# EAGLE design Frequency_Control (EAGLE 6.3)
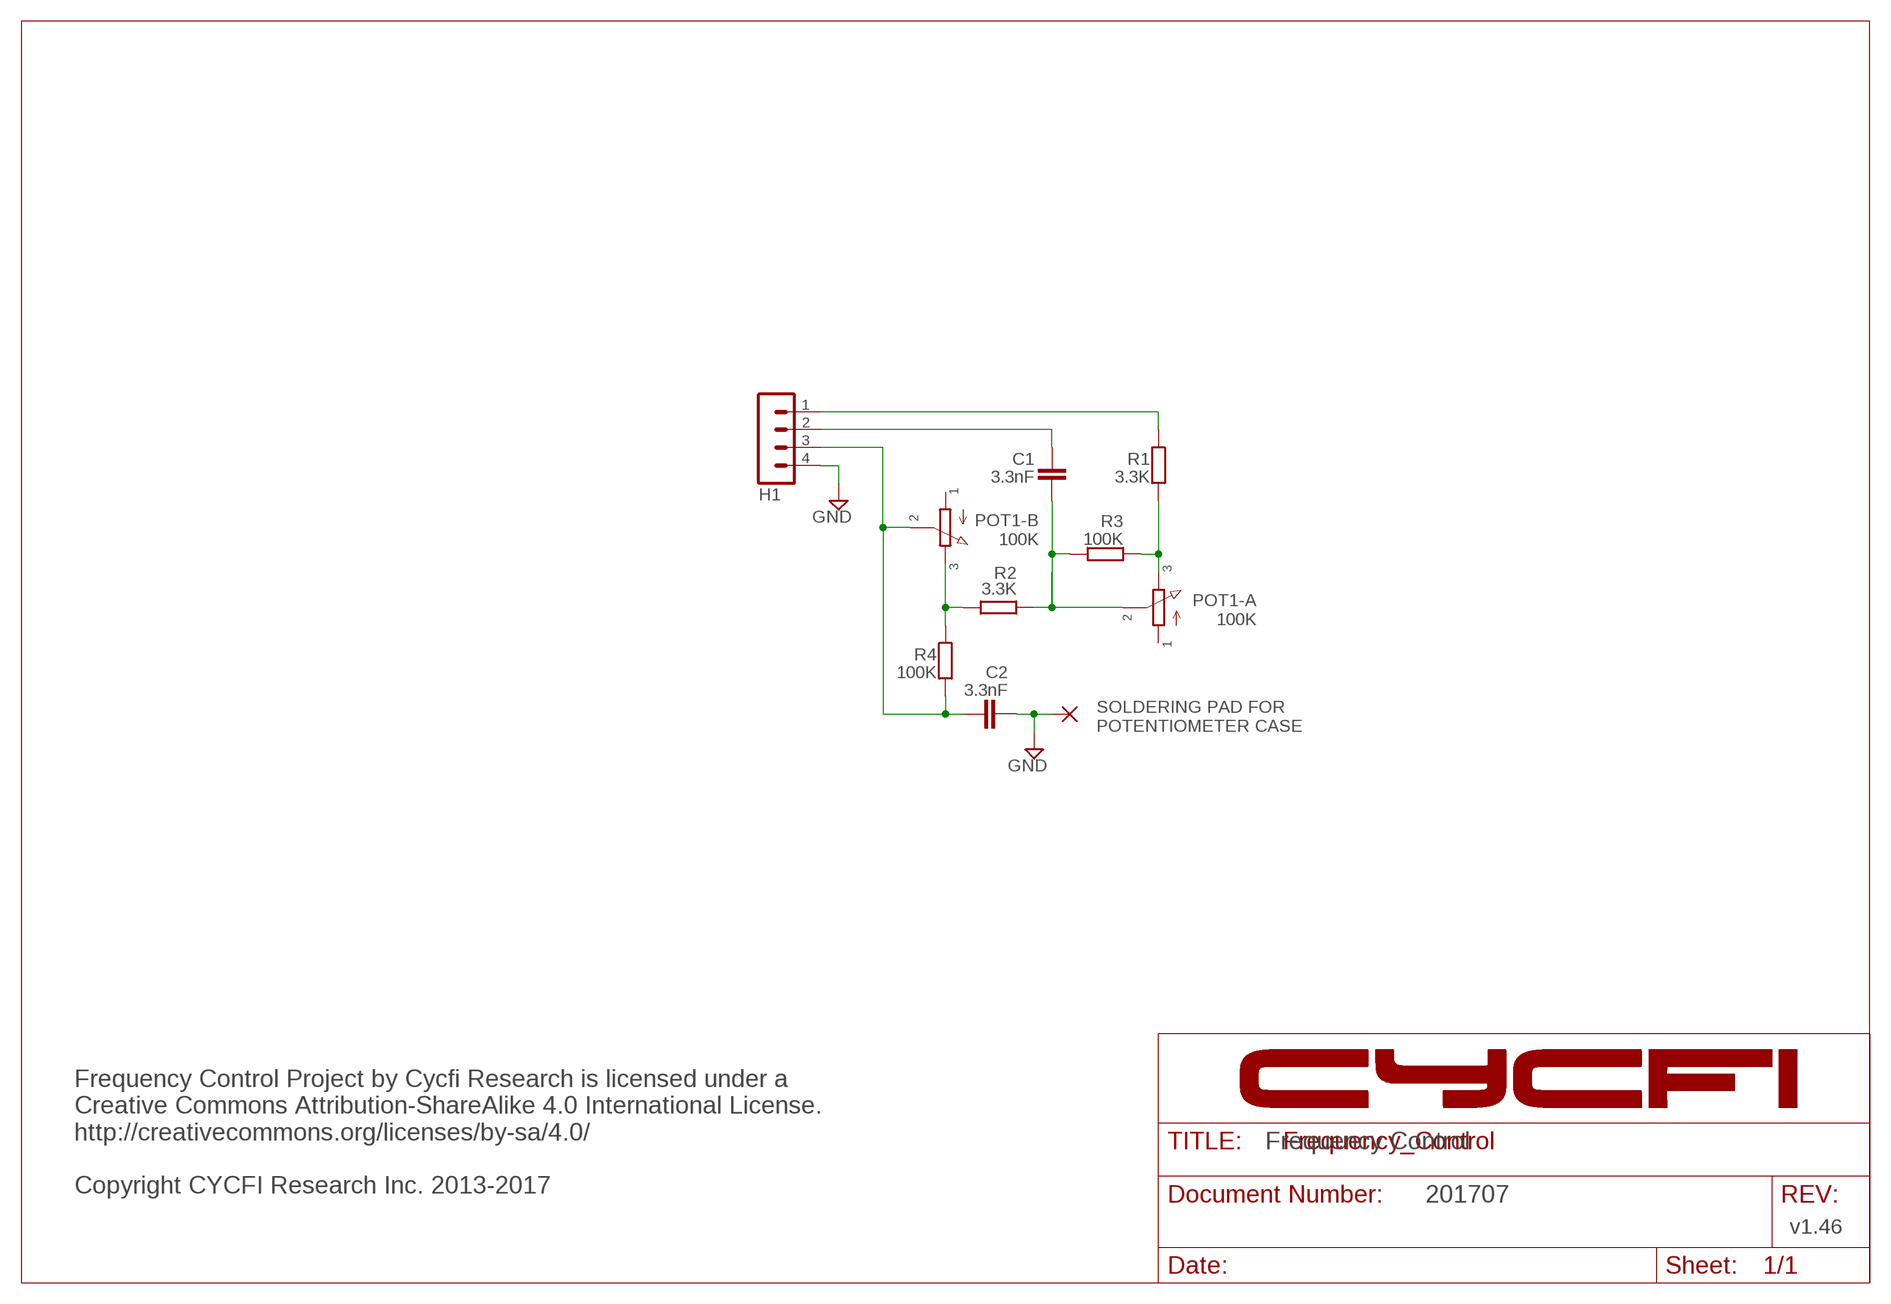
[diagram p0: schematic, sheet 1]

## Parts
C1  3.3nF  C-EUC0805  [C0805]
C2  3.3nF  C-EUC0805  [C0805]
H1  MA04-1  [MA04-1]
PAD1  1,6/0,9  [1,6/0,9]
POT1-A  PDB182-GTR02  [PDB182-GTR01]
R1  3.3K  R-EU_R0603  [R0603]
R2  3.3K  R-EU_R0603  [R0603]
R3  100K  R-EU_R0402  [R0402]
R4  100K  R-EU_R0402  [R0402]

## Nets
1: H1.1 R1.1
2: C1.2 H1.2
3: C2.1 H1.3 POT1-A.B2 R4.2
GND: C2.2 H1.4 PAD1.1(P)
N$1: POT1-A.A3 R1.2 R3.2
N$2: C1.1 POT1-A.A2 R2.1 R3.1
N$3: POT1-A.B3 R2.2 R4.1
Unconnected: POT1-A.A1 POT1-A.B1

## Notes on the sheet
- POT1-B
  100K
- POT1-A
  100K
- SOLDERING PAD FOR 
  POTENTIOMETER CASE
- Frequency Control
- Frequency Control Project by Cycfi Research is licensed under a 
  Creative Commons Attribution-ShareAlike 4.0 International License. 
  http://creativecommons.org/licenses/by-sa/4.0/ 
  
  Copyright CYCFI Research Inc. 2013-2017
- 201707
- v1.46

## Library data of the parts
C1 C2 = resistor:C-EU: CAPACITOR, European symbol
H1 = con-lstb:MA04-1: PIN HEADER; OC_FARNELL: unknown; OC_NEWARK: unknown
PAD1 = wirepad:1,6/0,9: THROUGH-HOLE PAD
POT1-A = CYCFI_Passive:PDB182-GTR02
R1-R4 = resistor:R-EU_: RESISTOR, European symbol

## Board
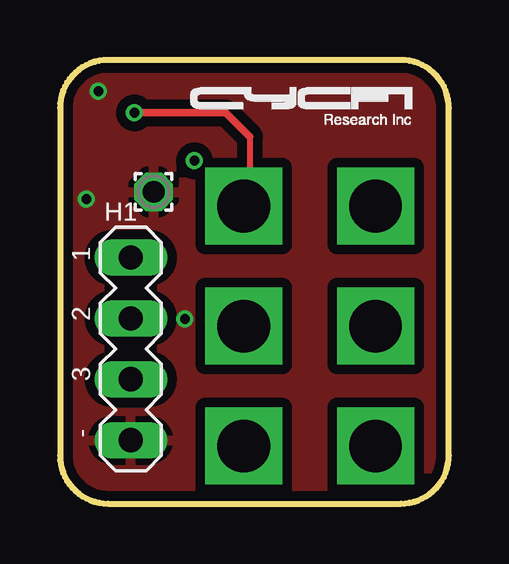
[diagram p1: board, top side]
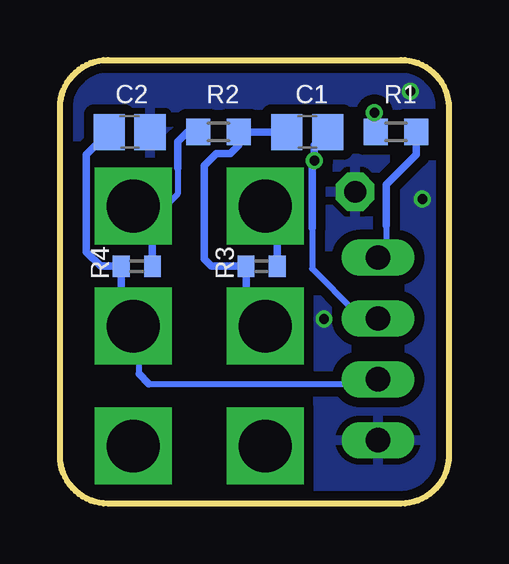
[diagram p2: board, bottom side, seen from below]

Size 16.2 x 18.5 mm. Coordinates in mm from the lower left corner, seen from the top.
Outline: 16.2,2 16.2,16.5 arc90 14.2,18.5 2,18.5 arc90 0,16.5 0,2 arc90 2,0 14.2,0 arc90 16.2,2
Copper layers (1*16): Top 0.035mm / dielectric 1.5mm / Bottom 0.035mm
Design rules "Elecrow_2-layer_eagle_rule": minimum track width 6mil, minimum drill 12mil, track to track 6mil, track to pad 6mil, pad to pad 6mil, via to via 6mil, smd to smd 0mil, copper to edge 10mil, drill to drill 10mil, minimum pad ring 10mil, minimum via ring 6mil, stop-mask expansion 2mil, vias tented up to drill 100mil, thermal gap 10mil

### Footprints (pad centres in the part's own frame; a part is rotated, then mirrored left to right if it is on the bottom)
C0805 = smd 1.3 x 1.5: 1 -0.85,0; 2 0.85,0
MA04-1 = drill 1.016 long: 1 -3.81,0; 2 -1.27,0; 3 1.27,0; 4 3.81,0
1,6/0,9 = drill 0.914 pad 1.6 octagon: 1 0,0
PDB182-GTR01 = drill 2.2 square: A1 -2.75,-5; A2 -2.75,0; A3 -2.75,5; B1 2.75,-5; B2 2.75,0; B3 2.75,5
R0603 = smd 1 x 1.1: 1 -0.85,0; 2 0.85,0
R0402 = smd 0.7 x 0.9: 1 -0.65,0; 2 0.65,0

### Placement (x,y rotation side)
C1  5.9,15.5 0 bottom
C2  13.3,15.5 0 bottom
H1  2.95,6.45 270 top
PAD1  3.9,13 0 top
POT1-A  10.4,7.4 0 top
R1  2.2,15.5 180 bottom
R2  9.6,15.5 180 bottom
R3  7.8,9.9 0 bottom
R4  13,9.9 180 bottom

### Tracks (layer width: path | path; a pad name or v marks a point on that pad's centre or on a via)
1
  Bottom 0.254: 2.6,11.6 2.6,10.61 H1.1
  Bottom 0.305: 2.6,11.6 2.6,13.3 1.35,14.55 R1.1
2  (via drill 0.4)
  Bottom 0.254: 5.7,11.5 5.7,9.8 3.9,8 3.23,8 H1.2
  Bottom 0.305: C1.2 5.6,14.95 v5.6,14.3 5.7,14.2 5.7,11.5
3
  Bottom 0.254: 12.9,5.4 12.9,7.15 POT1-A.B2 13.65,7.9 13.65,8.15 | 12.5,5 3.13,5 H1.3
  Bottom 0.305: 13.65,8.15 R4.2 14.5,9.9 15.1,10.5 15.1,14.55 C2.1 | 12.5,5 12.9,5.4
GND  (via drill 0.4)
  other vias: 5.2,7.7 1.1,12.7 1.6,17.2
  pour Top (isolate 0.406): 14.2,0 2,0 arc-90 0,2 0,16.5 arc-90 2,18.5 14.2,18.5 arc-90 16.2,16.5 16.2,2 arc-90
  pour Bottom (isolate 0.406): 14.2,0 2,0 arc-90 0,2 0,16.5 arc-90 2,18.5 14.2,18.5 arc-90 16.2,16.5 16.2,2 arc-90
N$1  (via drill 0.4)
  Top 0.254: 7.9,15.3 7.9,12.65 POT1-A.A3
  Top 0.305: v3.1,16.3 6.9,16.3 7.9,15.3
  Bottom 0.254: 7.15,11.65 7.15,11.9 POT1-A.A3
  Bottom 0.305: R3.2 7.15,11.65 | R1.2 3.05,16.25 v3.1,16.3
N$2
  Bottom 0.254: POT1-A.A2 7.9,7.4 8.45,7.95
  Bottom 0.305: 8.45,7.95 R3.1 9.9,9.9 10.2,10.2 10.2,14.1 9.7,14.6 9.1,14.6 8.75,14.95 R2.1 C1.1
N$3
  Bottom 0.254: 11.3,14 11.3,12.9 12.35,11.85 12.9,12.4 POT1-A.B3
  Bottom 0.305: R4.1 12.35,11.85 | R2.2 10.9,15.5 11.3,15.1 11.3,14

### Text on the board
tNames: 1 | 2 | 3 | -
_tNames: H1 | 1 | 2 | 3 | -
_bNames: R1 | C1 | R2 | C2 | R3 | R4